# Altium schematic sheet 03_mcu_io.SchDoc
size A; SheetNumber: 15; SheetTotal: 17
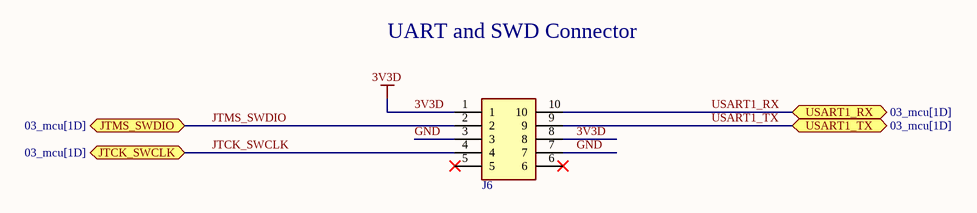
[diagram p0: 03_mcu_io.SchDoc]

## Parts
J6  TC2050-IDC  [TAG-CONNECT_TC2050-IDC]  (value not drawn)

## Ports
JTCK_SWCLK (bidir, see 03_mcu[1D]), JTMS_SWDIO (bidir, see 03_mcu[1D]), USART1_RX (bidir, see 03_mcu[1D]), USART1_TX (bidir, see 03_mcu[1D])

## Nets
3V3D: J6.1 J6.8
GND: J6.3 J6.7
JTCK_SWCLK: J6.4 ; port JTCK_SWCLK
JTMS_SWDIO: J6.2 ; port JTMS_SWDIO
USART1_RX: J6.10 ; port USART1_RX
USART1_TX: J6.9 ; port USART1_TX

Not connected (* = marked no-connect by the designer): J6 5* 6*

## Notes on the sheet
- UART and SWD Connector

## Library data of the parts
J6 = TC2050-IDC: Cbl Plug-Of-Nails 10-Pin w/Legs; Package: None; Availability: Unavailable; Value: *; MP: TC2050-IDC; Price: None